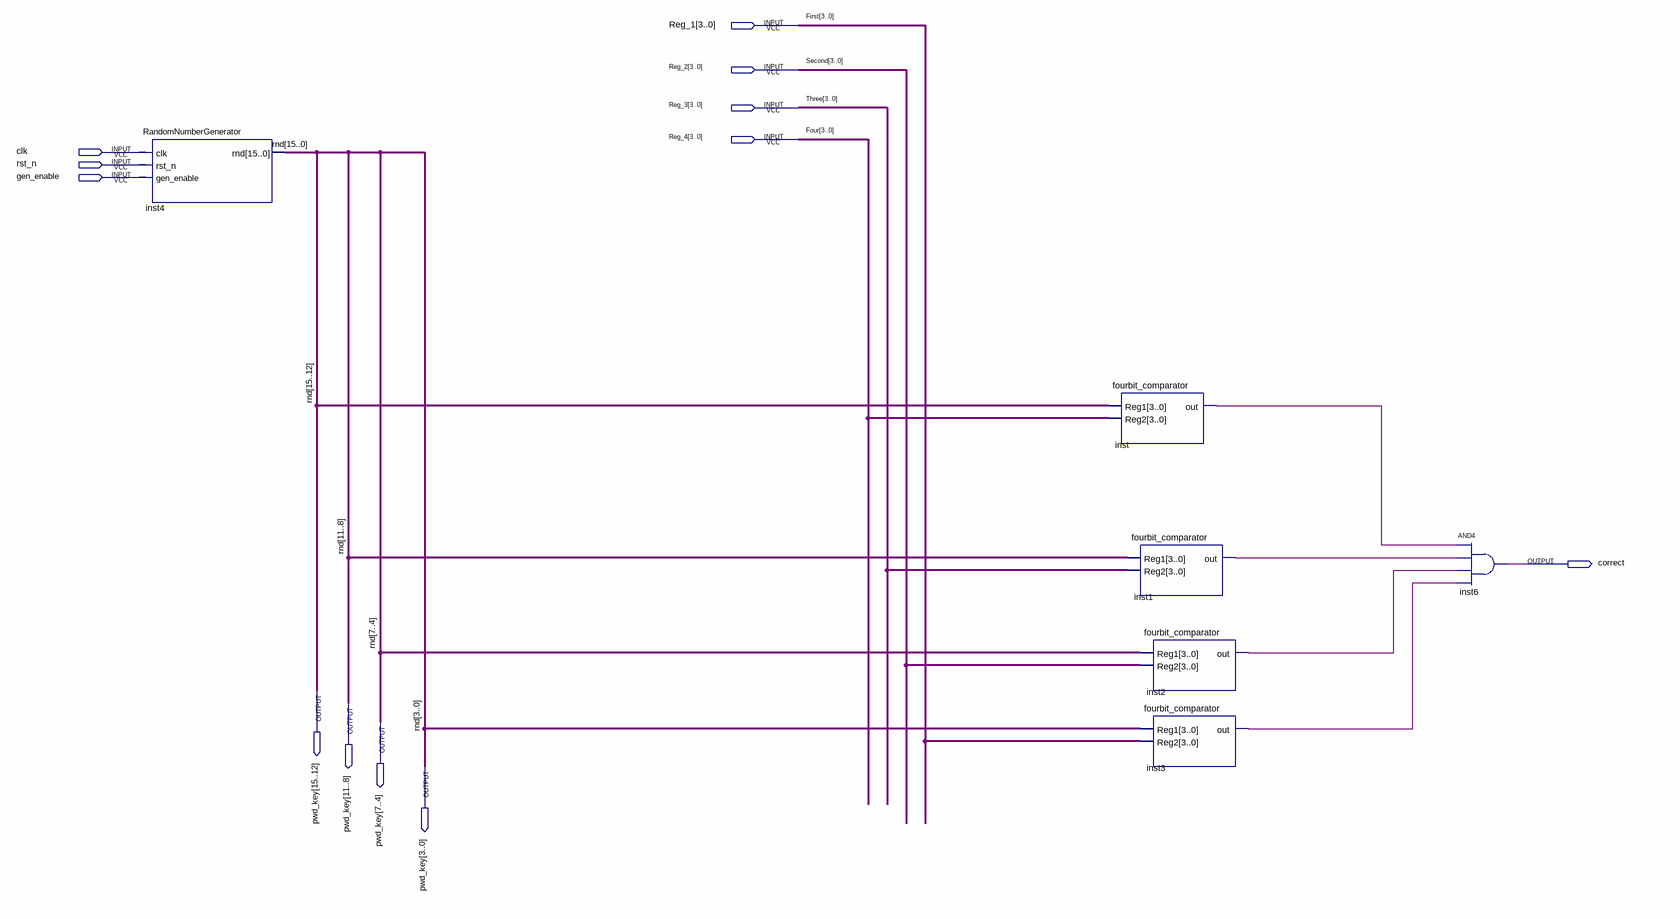
[diagram p0: schematic sheet]
// Quartus schematic Password.bdf as structural Verilog: 6 symbols, 12 pins
module Password (
  input  [3:0] Reg_1,
  input  [3:0] Reg_2,
  input  [3:0] Reg_3,
  input  [3:0] Reg_4,
  input  clk,
  input  rst_n,
  input  gen_enable,
  output correct,
  output [15:0] pwd_key
);

  wire inst1_out, inst2_out, inst3_out, inst_out;

  RandomNumberGenerator inst4 (.clk(clk), .rst_n(rst_n), .gen_enable(gen_enable), .rnd(pwd_key));
  fourbit_comparator inst (.Reg1(pwd_key[15:12]), .Reg2(Reg_4), .out(inst_out));
  fourbit_comparator inst1 (.Reg1(pwd_key[11:8]), .Reg2(Reg_3), .out(inst1_out));
  fourbit_comparator inst2 (.Reg1(pwd_key[7:4]), .Reg2(Reg_2), .out(inst2_out));
  fourbit_comparator inst3 (.Reg1(pwd_key[3:0]), .Reg2(Reg_1), .out(inst3_out));
  and inst6 (correct, inst_out, inst1_out, inst2_out, inst3_out);

  // Other names for the same wires on the sheet: First[3:0] = Reg_1; Four[3:0] = Reg_4; rnd[15:0] = pwd_key;
  //   Second[3:0] = Reg_2; Three[3:0] = Reg_3
endmodule
